# EAGLE design Power switch robot kecil - Copy (EAGLE 9.5.0)
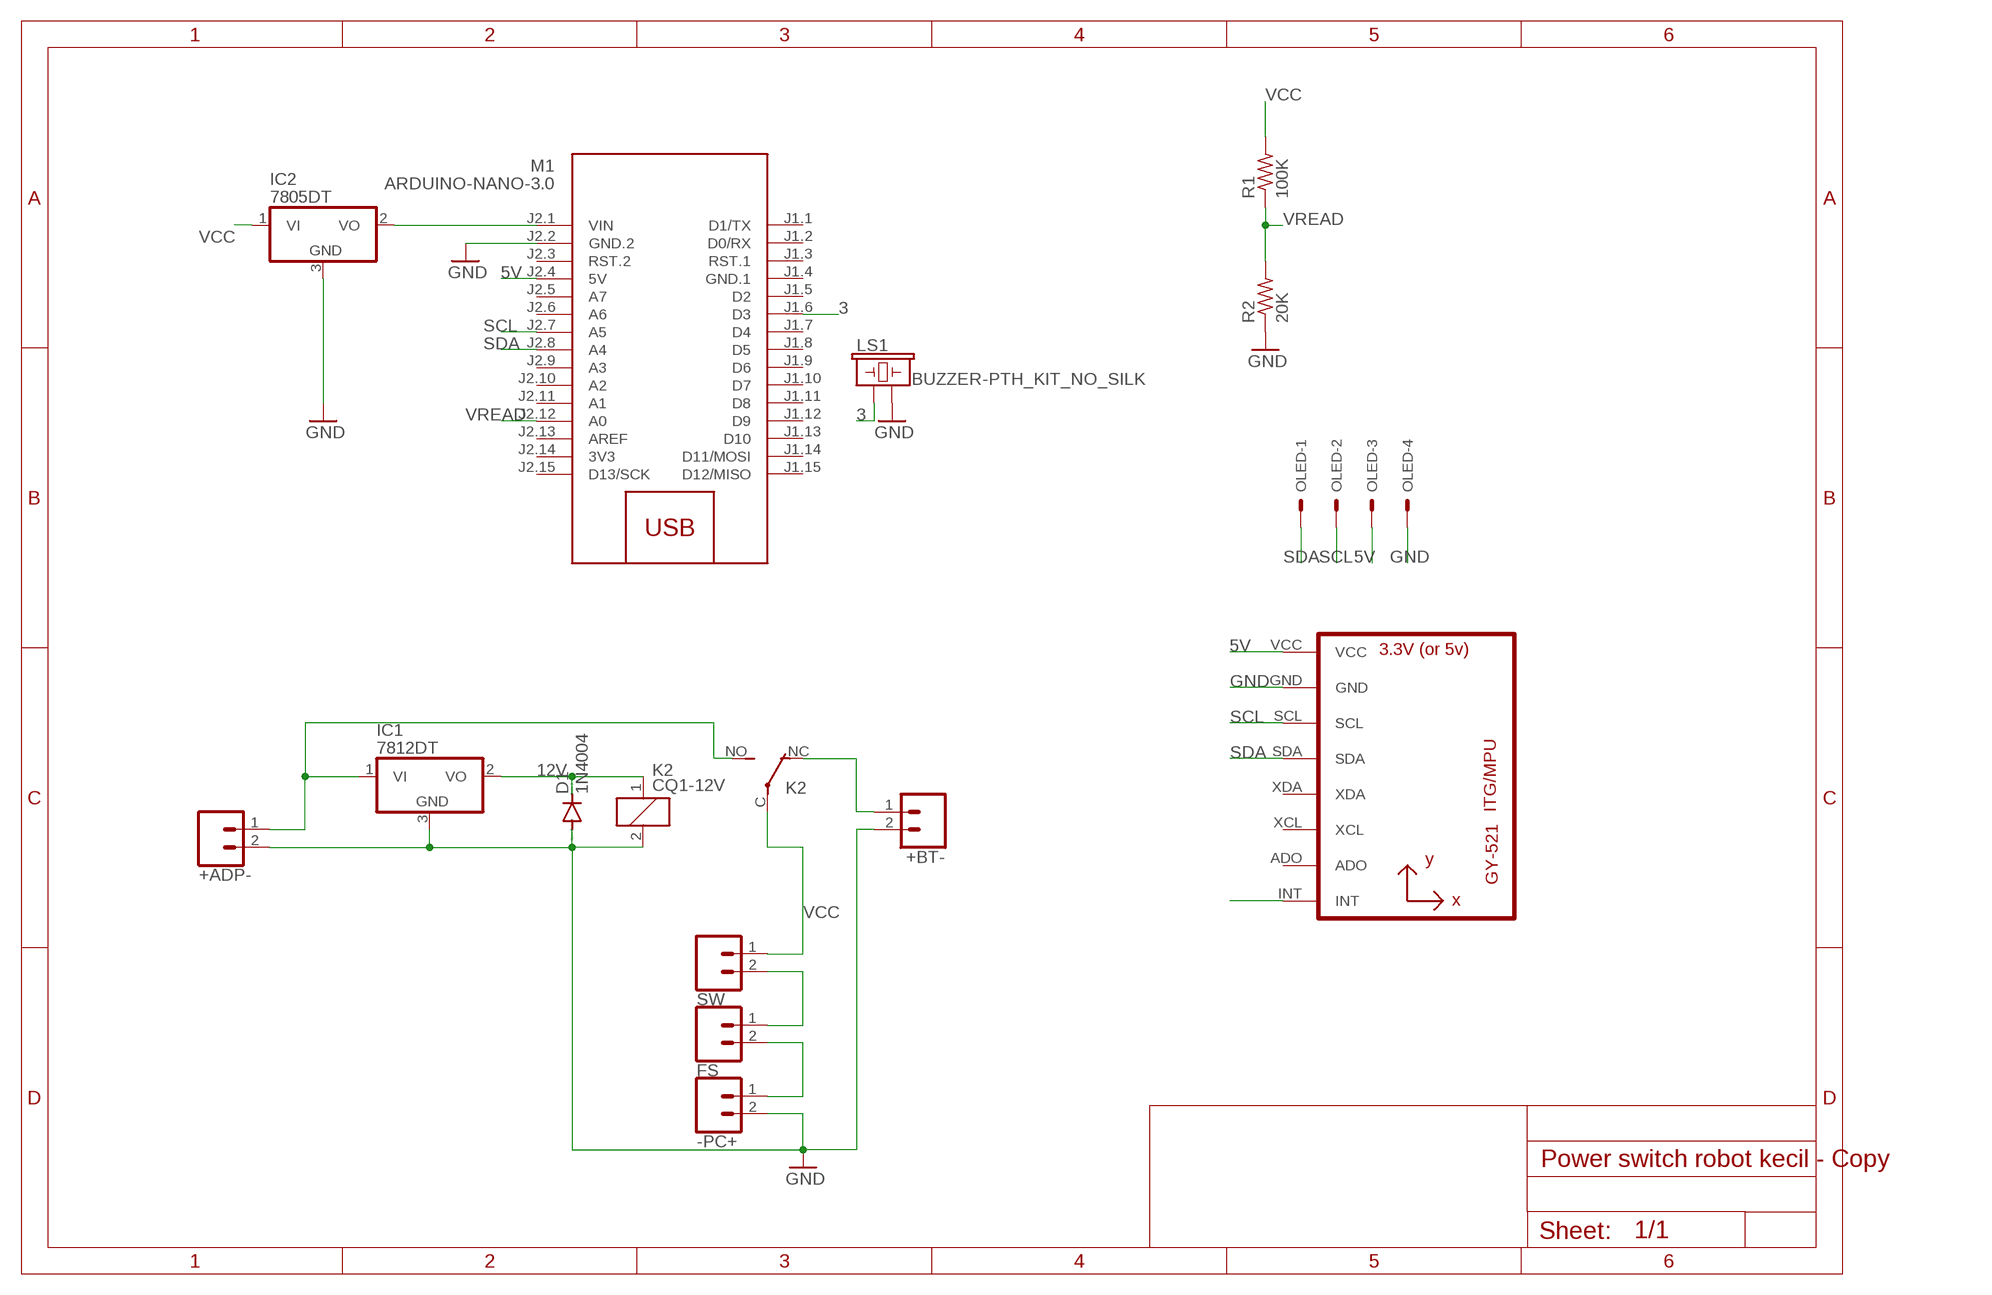
[diagram p0: schematic, sheet 1]

## Parts
+ADP-  CONN_02LOCK_LONGPADS  [1X02_LOCK_LONGPADS]
+BT-  CONN_02LOCK_LONGPADS  [1X02_LOCK_LONGPADS]
-PC+  CONN_02LOCK_LONGPADS  [1X02_LOCK_LONGPADS]
D1  1N4004  [DO41-10]
FS  CONN_02LOCK_LONGPADS  [1X02_LOCK_LONGPADS]
IC1  7812DT  [TO252]
IC2  7805DT  [TO252]
K2  CQ1-12V  [CQ1]
LS1  BUZZER-PTH_KIT_NO_SILK  [BUZZER-12MM-NS-KIT]
M1  ARDUINO-NANO-3.0  [ARDUINO-NANO-3.0]
OLED  22-27-2041-04  [6410-04]
R1  100K  R-US_0207/10  [0207/10]
R2  20K  R-US_0207/10  [0207/10]
SW  CONN_02LOCK_LONGPADS  [1X02_LOCK_LONGPADS]
U1  GY-521MPU6050  [GY-521]

## Nets
3: LS1.+ M1.J1.6(D3)
5V: M1.J2.4(5V) OLED.3 U1.VCC
12V: D1.C IC1.2(VO) K2.1
GND: +ADP-.2 +BT-.2 -PC+.2 D1.A IC1.3(GND) IC2.3(GND) K2.2 LS1.- M1.J2.2(GND.2) OLED.4 R2.1 U1.GND
N$1: +ADP-.1 IC1.1(VI) K2.NO(2:S)
N$3: +BT-.1 K2.NC(2:O)
N$4: -PC+.1 FS.2
N$5: FS.1 SW.2
N$6: IC2.2(VO) M1.J2.1(VIN)
N$12: U1.INT
SCL: M1.J2.7(A5) OLED.2 U1.SCL
SDA: M1.J2.8(A4) OLED.1 U1.SDA
VCC: IC2.1(VI) K2.C(2:P) R1.2 SW.1
VREAD: M1.J2.12(A0) R1.1 R2.2
Unconnected: M1.J1.1(D1/TX) M1.J1.2(D0/RX) M1.J1.3(RST.1) M1.J1.5(D2) M1.J1.7(D4) M1.J1.8(D5) M1.J1.9(D6) M1.J1.10(D7) M1.J1.11(D8) M1.J1.12(D9) M1.J1.13(D10) M1.J1.14(D11/MOSI) M1.J1.15(D12/MISO) M1.J2.3(RST.2) M1.J2.5(A7) M1.J2.6(A6) M1.J2.9(A3) M1.J2.10(A2) M1.J2.11(A1) M1.J2.13(AREF) M1.J2.15(D13/SCK) U1.ADO U1.XCL U1.XDA

## Power pins joined to a net without a drawn wire
3V3: M1.J2.14(3V3)
GND.1: M1.J1.4(GND.1)

## Library data of the parts
+ADP- +BT- -PC+ FS SW = SparkFun-Connectors:CONN_02: Multi connection point. Often used as Generic Header-pin footprint for 0.1 inch spaced/style header connections On any of the 0.1 inch spaced packages, you can populate with these: Break Away Headers - Straight <https://www.sparkfun.com/products/116> (PRT-00116) Break Away Male Headers - Right Angle <https://www.sparkfun.com/products/553> (PRT-00553) Female Headers <https://www.sparkfun.com/products/115> (PRT-00115) Break Away Headers - Machine Pin <https://www.sparkfun.com/products/117> (PRT-00117) Break Away Female Headers - Swiss Machine Pin <https://www.sparkfun.com/products/743> (PRT-00743) For SCREWTERMINALS and SPRING TERMINALS visit here: Screw Terimnals on SparkFun.com <https://www.sparkfun.com/search/results?term=Screw+Terminals> (5mm/3.5mm/2.54mm spacing) This device is also useful as a general connection point to wire up your design to another part of your project. Our various solder wires solder well into these plated through hole pads. Hook-Up Wire - Assortment (Stranded, 22 AWG) <https://www.sparkfun.com/products/11375> (PRT-11375) Hook-Up Wire - Assortment (Solid Core, 22 AWG) <https://www.sparkfun.com/products/11367> (PRT-11367) View the entire wire category on our website here <https://www.sparkfun.com/categories/141> Special notes: Molex polarized connector foot print use with: PRT-08233 with associated crimp pins and housings. 2.54_SCREWTERM for use with PRT-10571. 3.5mm Screw Terminal footprints for PRT-08084 5mm Screw Terminal footprints for use with PRT-08432
D1 = diode:1N4004: DIODE general purpose rectifier, 1 A
IC1 IC2 = linear:78*: Positive VOLTAGE REGULATOR Source: http://cache.national.com/ds/LM/LM78L05.pdf http://www.fairchildsemi.com/ds/LM/LM7805.pdf
K2 = relay:CQ1-12V: AUTOMOTIVE QUIET RELAY NAiS Source: http://www.mew-europe.com/.. en_ds_61208_0000.pdf; OC_FARNELL: unknown; OC_NEWARK: unknown
LS1 = SparkFun-Electromechanical:BUZZER: Buzzer Small round buzzers that operate around the audible 2kHz range. You can use these as speakers to create simple music or user interfaces. Variant Overview: PTH - Mini Speaker - PC Mount 12mm 2.048kHz <https://www.sparkfun.com/products/7950> PTH_KIT - Mini Speaker - PC Mount 12mm 2.048kHz <https://www.sparkfun.com/products/7950> KIT simplifies soldering by adding stop mask to one side of the pads. PTH_NO_SILK - Mini Speaker - PC Mount 12mm 2.048kHz <https://www.sparkfun.com/products/7950> No silkscreen indicator of buzzer outline. PTH_KIT_NO_SILK - Mini Speaker - PC Mount 12mm 2.048kHz <https://www.sparkfun.com/products/7950> KIT package w/o silkscreen SMD - Buzzer Audio Magnetic (CCV-084B16) SMD buzzer used on, e.g. the LilyPad Buzzer <https://www.sparkfun.com/products/8463> and RFID USB Reader <https://www.sparkfun.com/products/9963>. SMD_KIT - Buzzer Audio Magnetic (CCV-084B16) SMD Buzzer with elongated pins to make soldering easier. Used on the SparkFun Simon Says - Surface Mount Soldering Kit <https://www.sparkfun.com/products/10935>.; PROD_ID: COMP-08253; SF_SKU: COM-07950
M1 = diy-modules:ARDUINO-NANO-3.0: Arduino Nano 3.0 and compatible devices More details available here: https://www.arduino.cc/en/Main/ArduinoBoardNano Click here to find device on ebay.com <http://www.ebay.com/sch/arduino+nano>
OLED = con-molex:22-?-04: CONNECTOR wire to board 2.54 mm (.1 inch) pitch header; MF: MOLEX; OC_FARNELL: unknown; OC_NEWARK: unknown
R1 R2 = rcl:R-US_: RESISTOR, American symbol; SPICEPREFIX: R
U1 = gy-521:GY-521

## Board
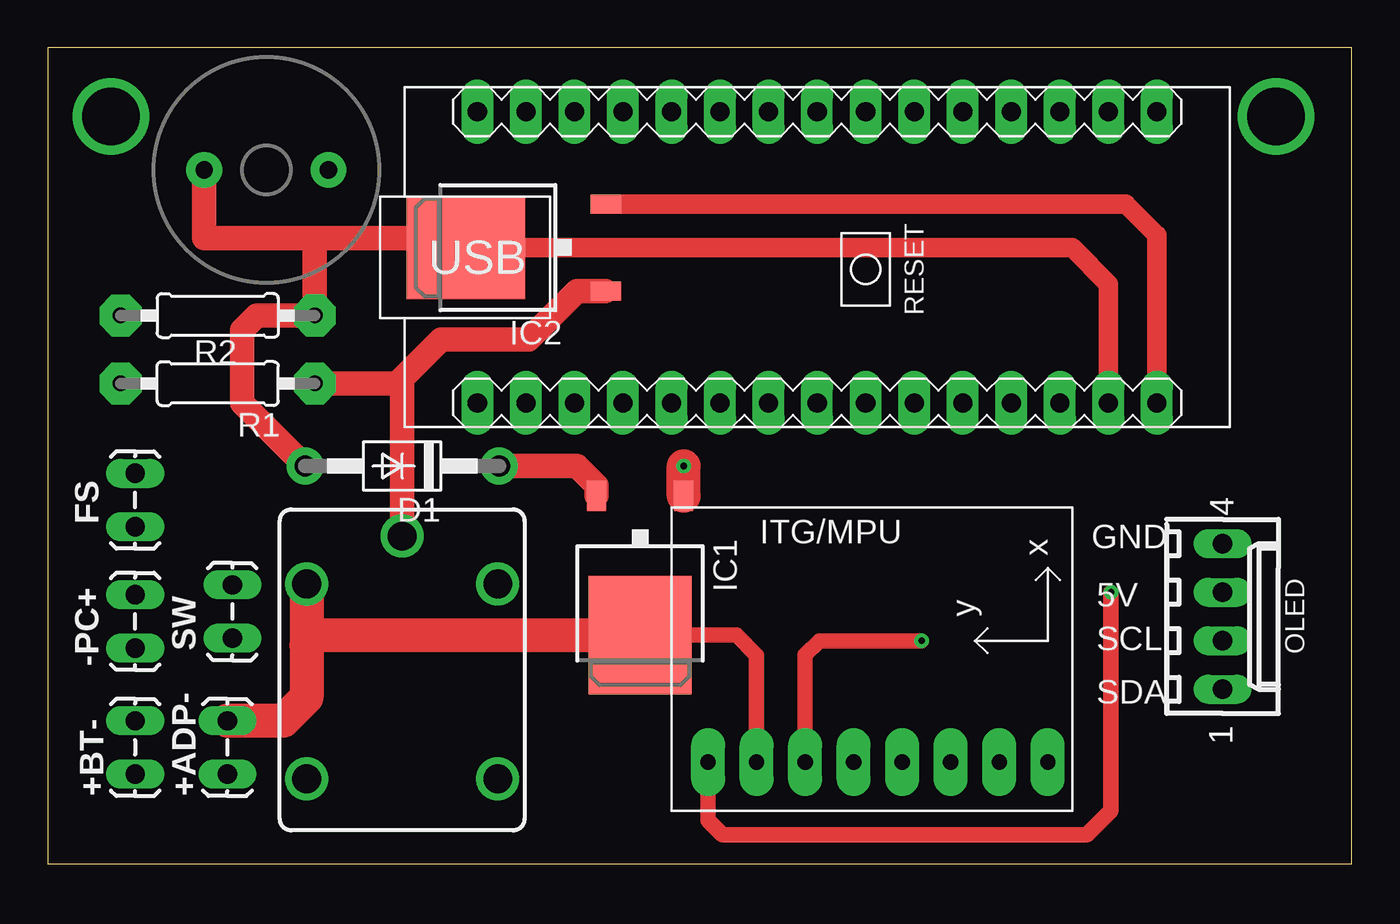
[diagram p1: board, top side]
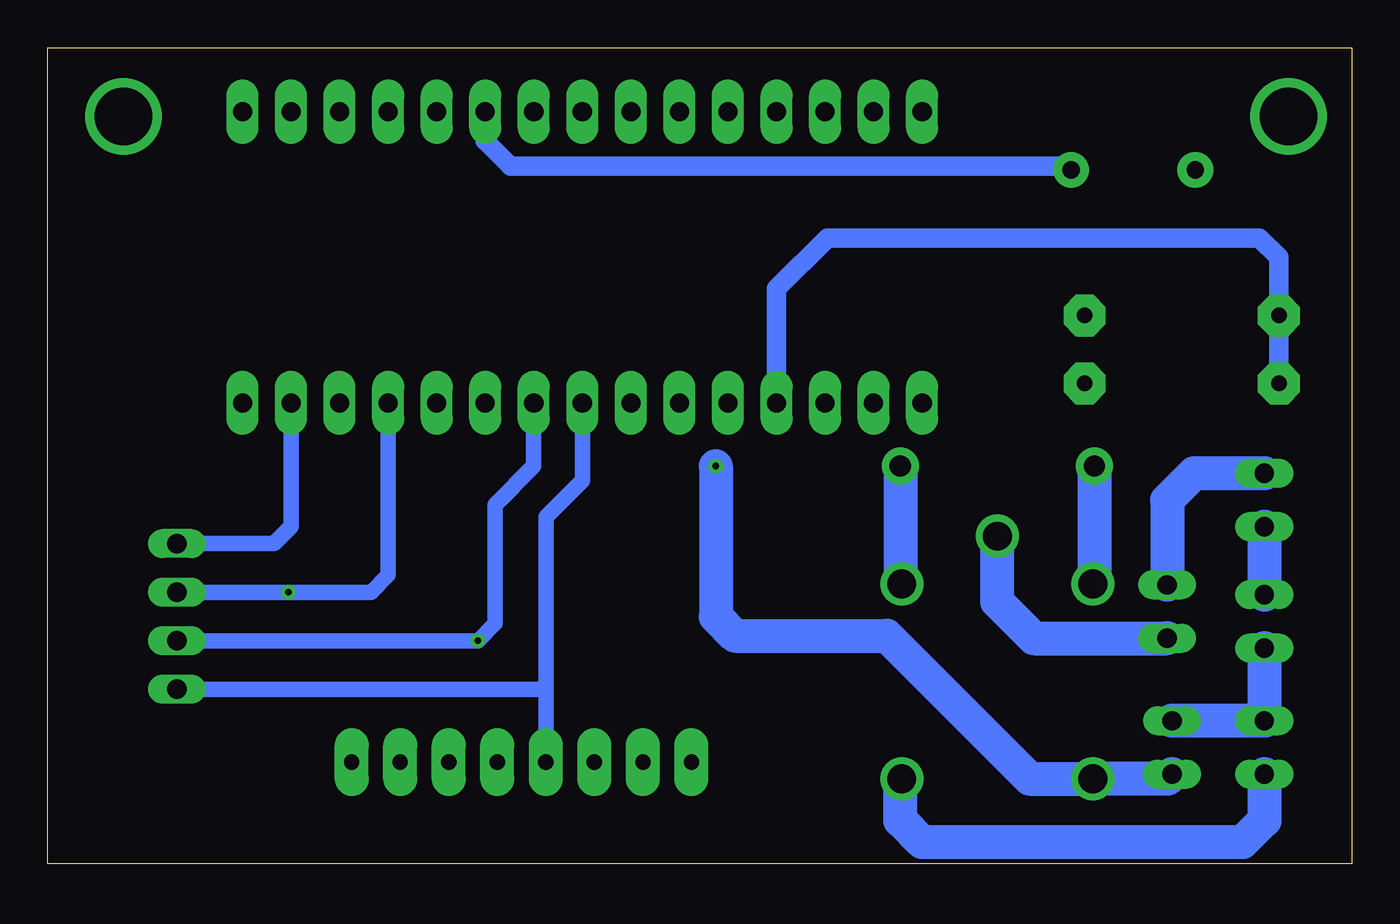
[diagram p2: board, bottom side, seen from below]

Size 68.22 x 42.71 mm. Coordinates in mm from the lower left corner, seen from the top.
Outline: 0,0 68.22,0 68.22,42.71 0,42.71 0,0
Copper layers (1*16): Top 0.035mm / dielectric 1.5mm / Bottom 0.035mm
Design rules "default": minimum track width 6mil, minimum drill 0.35mm, track to track 24mil, track to pad 24mil, pad to pad 24mil, via to via 24mil, smd to smd 24mil, copper to edge 40mil, drill to drill 6mil, minimum pad ring 10mil, minimum via ring 8mil, stop-mask expansion 4mil, vias tented up to drill 0mil, thermal gap 10mil

### Footprints (pad centres in the part's own frame; a part is rotated, then mirrored left to right if it is on the bottom)
1X02_LOCK_LONGPADS = drill 1.016 long: 1 -0.127,0; 2 2.667,0
DO41-10 = drill 1.118 pad 1.93: A 5.08,0; C -5.08,0
TO252 = smd 1 x 1.6: 1 -2.28,-4.8; 2 2.28,-4.8 | smd 5.4 x 6.2: 3 0,2.5
CQ1 = drill 1.5: 1 4.5,-5; 2 4.5,5; C 7,0; NC -5.7,-5; NO -5.7,5
BUZZER-12MM-NS-KIT = drill 0.9 pad 1.88: + 3.25,0; - -3.25,0
ARDUINO-NANO-3.0 = drill 1 pad 1.676 long: J1.1 17.78,7.62; J1.2 15.24,7.62; J1.3 12.7,7.62; J1.4 10.16,7.62; J1.5 7.62,7.62; J1.6 5.08,7.62; J1.7 2.54,7.62; J1.8 0,7.62; J1.9 -2.54,7.62; J1.10 -5.08,7.62; J1.11 -7.62,7.62; J1.12 -10.16,7.62; J1.13 -12.7,7.62; J1.14 -15.24,7.62; J1.15 -17.78,7.62; J2.1 17.78,-7.62; J2.2 15.24,-7.62; J2.3 12.7,-7.62; J2.4 10.16,-7.62; J2.5 7.62,-7.62; J2.6 5.08,-7.62; J2.7 2.54,-7.62; J2.8 0,-7.62; J2.9 -2.54,-7.62; J2.10 -5.08,-7.62; J2.11 -7.62,-7.62; J2.12 -10.16,-7.62; J2.13 -12.7,-7.62; J2.14 -15.24,-7.62; J2.15 -17.78,-7.62
6410-04 = drill 1.016 long: 1 3.81,0; 2 1.27,0; 3 -1.27,0; 4 -3.81,0
0207/10 = drill 0.813 pad 2.184 octagon: 1 -5.08,0; 2 5.08,0
GY-521 = drill 0.8 pad 1.778 long: ADO -8.89,-6.35; GND -8.89,6.35; INT -8.89,-8.89; SCL -8.89,3.81; SDA -8.89,1.27; VCC -8.89,8.89; XCL -8.89,-3.81; XDA -8.89,-1.27

### Placement (x,y rotation side)
+ADP-  9.4,4.83 90 top
+BT-  4.57,4.83 90 top
-PC+  4.57,13.97 270 top
D1  18.54,20.83 180 top
FS  4.57,20.32 270 top
IC1  30.99,14.48 180 top
IC2  24.38,32.26 90 top
K2  18.54,10.16 90 top
LS1  11.43,36.32 0 top
M1  40.25,31.75 0 top
OLED  61.47,12.95 270 top
R1  8.89,25.15 0 top
R2  8.89,28.7 180 top
SW  9.65,11.94 90 top
U1  43.43,14.22 90 top

### Tracks (layer width: path | path; a pad name or v marks a point on that pad's centre or on a via)
3
  Bottom 1.016: M1.J1.6 45.33,37.86 44,36.52 14.88,36.52 LS1.+
5V  (via drill 0.35)
  Top 0.813: U1.VCC 34.54,2.29 35.31,1.52 54.36,1.52 55.63,2.79 v55.63,14.22
  Bottom 0.813: M1.J2.4 50.41,15.12 51.31,14.22 v55.63,14.22 OLED.3
12V
  Top 1.27: IC1.2 28.71,19.81 27.69,20.83 D1.C
  Bottom 1.778: D1.C 23.62,14.74 K2.1
GND
  Top 0.813: U1.GND 37.08,10.92 36.03,11.98 31.5,11.98 IC1.3
  Top 1.016: 22.61,32.26 IC2.3 20.36,33.78 | 22.61,32.26 53.59,32.26 55.49,30.36 M1.J2.2 | 13.54,28.41 R2.1 | 22.1,32.77 22.61,32.26
  Top 1.27: IC2.3 21.08,32.26 20.27,33.07 | 13.97,32.77 R2.1 10.92,28.7 10.16,27.94 10.16,24.13 D1.A | 13.97,32.77 22.1,32.77 | 13.97,32.77 8.18,32.77 LS1.-
  Top 1.778: IC1.3 30.79,11.78 | K2.2 13.54,11.43 | 13.54,11.43 13.54,8.72 12.32,7.49 +ADP-.2 | 13.54,11.43 14.09,11.98 31.5,11.98
  Bottom 0.813: M1.J2.2 55.49,17.66 56.39,16.76 OLED.4
  Bottom 1.778: +ADP-.2 +BT-.2 -PC+.2 | K2.2 13.46,14.74 D1.A
N$1  (via drill 0.35)
  Top 1.27: v33.27,20.83 v33.27,20.82
  Top 1.778: IC1.1 v33.27,20.82
  Bottom 1.778: +ADP-.1 9.64,4.46 K2.NO 16.84,4.46 24.32,11.94 32.26,11.94 33.27,12.95 v33.27,20.83
N$2  (via drill 3)
  other vias: 3.3,39.12
N$3
  Bottom 1.778: +BT-.1 4.57,2.29 5.71,1.14 22.48,1.14 23.62,2.29 23.62,4.38 K2.NC
N$4
  Bottom 1.778: FS.2 -PC+.1
N$5
  Bottom 1.778: FS.1 8.26,20.45 9.65,19.05 SW.2
N$6
  Top 1.016: M1.J2.1 58.03,32.9 56.39,34.54 IC2.2
N$7  (via drill 3)
  other vias: 64.26,39.12
SCL  (via drill 0.35)
  Top 0.813: U1.SCL 39.62,10.93 40.38,11.68 v45.72,11.68
  Bottom 0.813: M1.J2.7 42.79,20.83 44.83,18.8 44.83,12.58 v45.72,11.68 OLED.2
SDA
  Bottom 0.813: OLED.1 42.16,9.14 | M1.J2.8 40.25,20.07 42.16,18.16 42.16,9.14 | 42.16,9.14 U1.SDA
VCC
  Top 1.016: IC2.1
  Top 1.27: IC2.1 27.69,29.97 25.15,27.43 20.57,27.43 18.54,25.4 18.54,25.15 | 18.54,25.15 K2.C | R1.2 18.54,25.15
  Bottom 1.778: K2.C 18.54,13.72 16.64,11.81 SW.1
VREAD
  Bottom 1.016: R1.1 R2.2 3.81,31.75 4.83,32.77 27.43,32.77 30.09,30.1 M1.J2.12

### Text on the board
tPlace: GND | 5V | SCL | SDA